# Altium schematic sheet PowerSwitch.SchDoc
size A
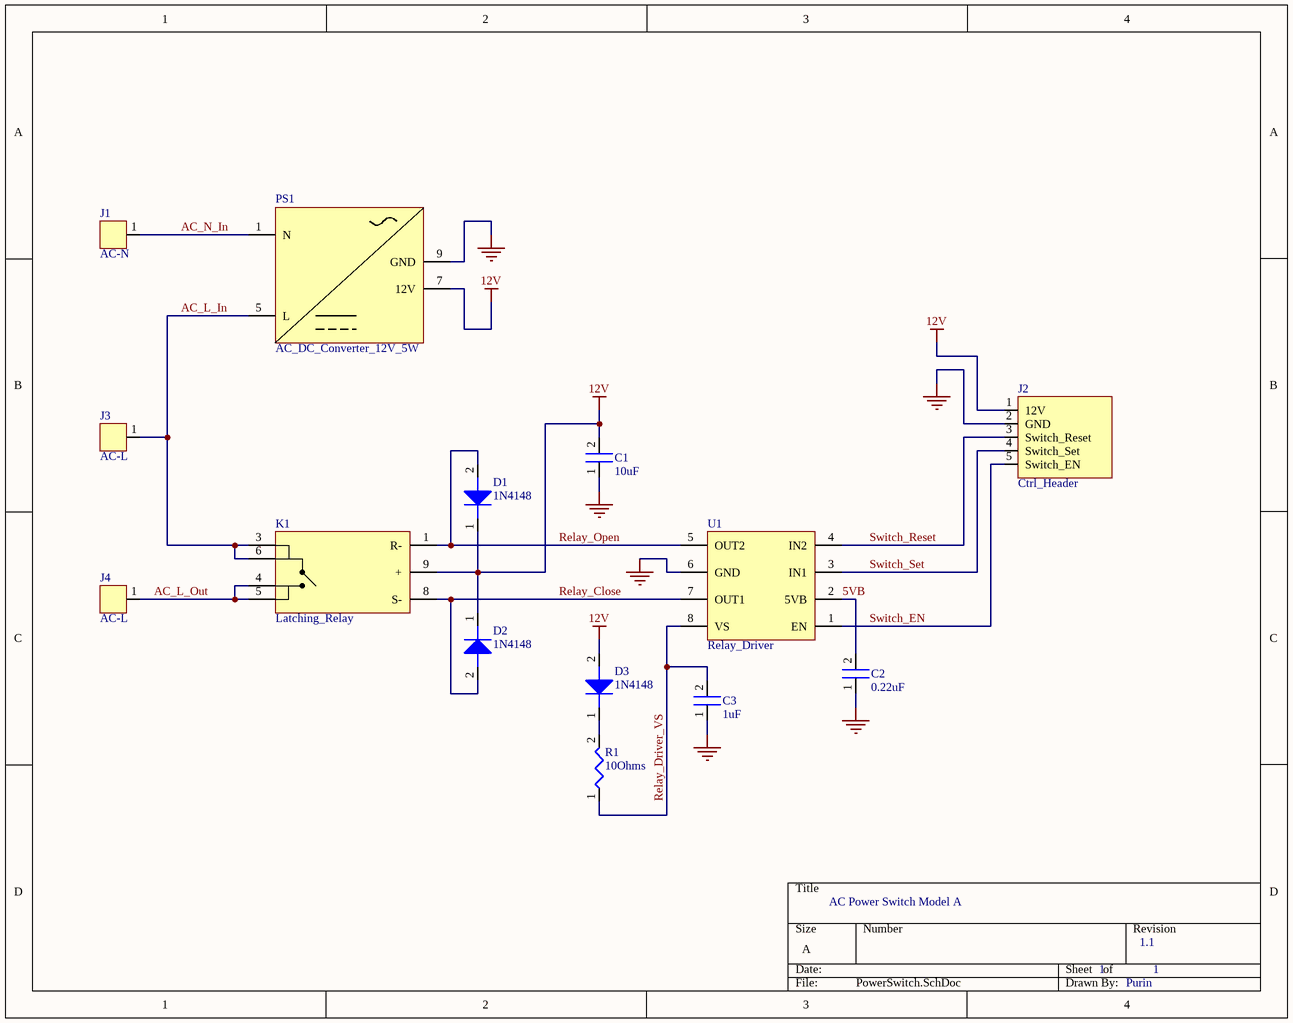
[diagram p0: PowerSwitch.SchDoc]

## Parts
C1  10uF  [C0805]
C2  0.22uF  [C0805]
C3  1uF  [C0805]
D1  1N4148  [1N4148SOD123]
D2  1N4148  [1N4148SOD123]
D3  1N4148  [1N4148SOD123]
J1  AC-N  [AC-HEADER]
J2  Ctrl_Header  [CTRL-HEADER]
J3  AC-L  [AC-HEADER]
J4  AC-L  [AC-HEADER]
K1  Latching_Relay  [G5RL-K1A-E]
PS1  AC_DC_Converter_12V_5W  [RAC05-K/277]
R1  10Ohms  [R0805]
U1  Relay_Driver  [FAN324X]

## Nets
12V: C1.2 D1.1 D2.1 D3.2 J2.1(12V) K1.9(+) PS1.7(12V)
GND: C1.1 C2.1 C3.1 J2.2(GND) PS1.9(GND) U1.6(GND)
5VB: C2.2 U1.2(5VB)
AC_L_In: J3.1(L) K1.3 K1.6 PS1.5(L)
AC_L_Out: J4.1(L) K1.4 K1.5
AC_N_In: J1.1(N) PS1.1(N)
Relay_Close: D2.2 K1.8(S-) U1.7(OUT1)
Relay_Driver_VS: C3.2 R1.1 U1.8(VS)
Relay_Open: D1.2 K1.1(R-) U1.5(OUT2)
Switch_EN: J2.5(Switch_EN) U1.1(EN)
Switch_Reset: J2.3(Switch_Reset) U1.4(IN2)
Switch_Set: J2.4(Switch_Set) U1.3(IN1)
NetD3_1: D3.1 R1.2

## Notes on the sheet
- AC Power Switch Model A
- 1
- 1.1
- Purin

## Library data of the parts
C1 = CL21B106KOQNNNE: 10µF ±10% 16V Ceramic Capacitor X7R 0805 (2012 Metric); Manufacturer: Samsung; Supplier 1: Digi-Key; Supplier Part Number 1: 1276-2872-1-ND; Manufacturer Part Number: CL21B106KOQNNNE; Stock 1: 6166622; Pricing 1: 1 = 0.30000, 10 = 0.20700, 100 = 0.11730, 500 = 0.08280, 1000 = 0.07245 (USD); Mount: Surface Mount; Case/Package: 0805; Case Code (Metric): 2012; Case Code (Imperial): 0805; Contact Plating: Tin; Min Operating Temperature: -55°C; Max Operating Temperature: 125°C; Tolerance: 10%; Packaging: Tape and Reel; Capacitance: 10uF; Voltage Rating: 16V; Package Quantity: 1; Dielectric: X7R; Voltage: 16V; Length: 2mm; Height: 1.25mm; Width: 0.049inch; Thickness: 0.055inch; Depth: 1.25mm; Radiation Hardening: No; ComponentLink1URL: https://datasheet.ciiva.com/16428/cl21b106koqnnne-16428887.pdf?src-supplier=Future+Electronics; ComponentLink1Description: https://datasheet.ciiva.com/16428/cl21b106koqnnne-16428887.pdf?src-supplier=Future+Electronics; ComponentLink2URL: https://datasheet.ciiva.com/25794/cl21b106koqnnne-25794472.pdf?src-supplier=Digi-Key; ComponentLink2Description: https://datasheet.ciiva.com/25794/cl21b106koqnnne-25794472.pdf?src-supplier=Digi-Key; ComponentLink3URL: https://datasheet.ciiva.com/26920/getdatasheetpartid-355170-26920201.pdf?src-supplier=Verical; ComponentLink3Description: https://datasheet.ciiva.com/26920/getdatasheetpartid-355170-26920201.pdf?src-supplier=Verical; ComponentLink4URL: http://datasheet.octopart.com/CL21B106KOQNNNE-Samsung-Electro-Mechanics-datasheet-11806859.pdf?src-supplier=Arrow; ComponentLink4Description: http://datasheet.octopart.com/CL21B106KOQNNNE-Samsung-Electro-Mechanics-datasheet-11806859.pdf?src-supplier=Arrow; ComponentLink5URL: http://datasheet.octopart.com/CL21B106KOQNNNE-Samsung-Electro-Mechanics-datasheet-81462191.pdf?src-supplier=Future+Electronics; ComponentLink5Description: http://datasheet.octopart.com/CL21B106KOQNNNE-Samsung-Electro-Mechanics-datasheet-81462191.pdf?src-supplier=Future+Electronics; ComponentLink6URL: http://datasheet.octopart.com/CL21B106KOQNNNE-Samsung-Electro-Mechanics-datasheet-8324245.pdf; ComponentLink6Description: http://datasheet.octopart.com/CL21B106KOQNNNE-Samsung-Electro-Mechanics-datasheet-8324245.pdf; ComponentLink7URL: http://datasheet.octopart.com/CL21B106KOQNNNE-Samsung-Electro-Mechanics-datasheet-116891046.pdf?src-supplier=Future+Electronics; ComponentLink7Description: http://datasheet.octopart.com/CL21B106KOQNNNE-Samsung-Electro-Mechanics-datasheet-116891046.pdf?src-supplier=Future+Electronics; ComponentLink8URL: http://datasheet.octopart.com/CL21B106KOQNNNE-Samsung-Electro-Mechanics-datasheet-136482503.pdf?src-supplier=Future+Electronics; ComponentLink8Description: http://datasheet.octopart.com/CL21B106KOQNNNE-Samsung-Electro-Mechanics-datasheet-136482503.pdf?src-supplier=Future+Electronics; ComponentLink9URL: http://datasheet.octopart.com/CL21B106KOQNNNE-Samsung-datasheet-12530662.pdf?src-supplier=Future+Electronics; ComponentLink9Description: http://datasheet.octopart.com/CL21B106KOQNNNE-Samsung-datasheet-12530662.pdf?src-supplier=Future+Electronics; ComponentLink10URL: http://datasheet.octopart.com/CL21B106KOQNNNE-Samsung-datasheet-26669285.pdf?src-supplier=Future+Electronics; ComponentLink10Description: http://datasheet.octopart.com/CL21B106KOQNNNE-Samsung-datasheet-26669285.pdf?src-supplier=Future+Electronics; Category: Ceramic Capacitors
C2 = CGA4J2X7R1H224K125AE: 0.22µF ±10% 50V Ceramic Capacitor X7R 0805 (2012 Metric); Manufacturer: TDK; Capacitance: 220nF; Supplier 1: Digi-Key; Supplier Part Number 1: 445-173771-1-ND; Manufacturer Part Number: CGA4J2X7R1H224K125AE; Stock 1: 7671; Pricing 1: 1 = 0.28000, 10 = 0.19000, 100 = 0.10790, 500 = 0.07618, 1000 = 0.06665 (USD); Mount: Surface Mount; Case/Package: 0805; Case Code (Metric): 2012; Case Code (Imperial): 0805; Min Operating Temperature: -55°C; Max Operating Temperature: 125°C; Packaging: Tape and Reel; Voltage Rating: 50V; Tolerance: 10%; Features: Soft Termination; Length: 0.079inch; Width: 0.047inch; Thickness: 0.059inch; Ratings: AEC-Q200; ComponentLink1URL: https://product.tdk.com/info/en/catalog/datasheets/mlcc_automotive_soft_en.pdf?src-supplier=Digi-Key; ComponentLink1Description: https://product.tdk.com/info/en/catalog/datasheets/mlcc_automotive_soft_en.pdf?src-supplier=Digi-Key; Category: Ceramic Capacitors
C3 = CGA4J3X7R1V105K125AB: 1µF ±10% 35V Ceramic Capacitor X7R 0805 (2012 Metric); Manufacturer: TDK; Supplier 1: Digi-Key; Supplier Part Number 1: 445-6962-1-ND; Manufacturer Part Number: CGA4J3X7R1V105K125AB; Stock 1: 3137; Pricing 1: 1 = 0.29000, 10 = 0.20100, 100 = 0.12080, 500 = 0.09056, 1000 = 0.07648 (USD); Mount: Surface Mount; Case/Package: 0805; Weight: 0.000194oz; Case Code (Imperial): 0805; Case Code (Metric): 2012; Min Operating Temperature: -55°C; Max Operating Temperature: 125°C; Tolerance: 10%; Packaging: Tape and Reel; Voltage Rating: 35V; Capacitance: 1uF; Voltage Rating (DC): 35V; Package Quantity: 1; Dielectric: X7R; Termination: SMD/SMT; Composition: Ceramic; Length: 2mm; Height: 1.25mm; Width: 1.25mm; Thickness: 0.057inch; Depth: 1.25mm; Ratings: AEC-Q200; REACH SVHC: No SVHC; Lead Free: Lead Free; ComponentLink1URL: https://datasheet.ciiva.com/24219/cga4j3x7r1v105k125ab-266016-24219602.pdf?src-supplier=Mouser; ComponentLink1Description: https://datasheet.ciiva.com/24219/cga4j3x7r1v105k125ab-266016-24219602.pdf?src-supplier=Mouser; ComponentLink2URL: https://datasheet.ciiva.com/8081/1807242-8081445.pdf?src-supplier=Element14; ComponentLink2Description: https://datasheet.ciiva.com/8081/1807242-8081445.pdf?src-supplier=Element14; ComponentLink3URL: https://datasheet.ciiva.com/22703/1807242-22703021.pdf?src-supplier=Element14; ComponentLink3Description: https://datasheet.ciiva.com/22703/1807242-22703021.pdf?src-supplier=Element14; ComponentLink4URL: http://datasheet.octopart.com/CGA4J3X7R1V105K125AB-TDK-datasheet-13376850.pdf?src-supplier=Newark; ComponentLink4Description: http://datasheet.octopart.com/CGA4J3X7R1V105K125AB-TDK-datasheet-13376850.pdf?src-supplier=Newark; ComponentLink5URL: http://datasheet.octopart.com/CGA4J3X7R1V105K125AB-TDK-datasheet-12542526.pdf?src-supplier=Newark; ComponentLink5Description: http://datasheet.octopart.com/CGA4J3X7R1V105K125AB-TDK-datasheet-12542526.pdf?src-supplier=Newark; ComponentLink6URL: http://datasheet.octopart.com/CGA4J3X7R1V105K125AB-TDK-datasheet-33009218.pdf?src-supplier=Newark; ComponentLink6Description: http://datasheet.octopart.com/CGA4J3X7R1V105K125AB-TDK-datasheet-33009218.pdf?src-supplier=Newark; ComponentLink7URL: http://datasheet.octopart.com/CGA4J3X7R1V105K125AB-TDK-datasheet-43366117.pdf?src-supplier=Newark; ComponentLink7Description: http://datasheet.octopart.com/CGA4J3X7R1V105K125AB-TDK-datasheet-43366117.pdf?src-supplier=Newark; ComponentLink8URL: http://datasheet.octopart.com/CGA4J3X7R1V105K125AB-TDK-datasheet-17817449.pdf?src-supplier=Future+Electronics; ComponentLink8Description: http://datasheet.octopart.com/CGA4J3X7R1V105K125AB-TDK-datasheet-17817449.pdf?src-supplier=Future+Electronics; ComponentLink9URL: http://datasheet.octopart.com/CGA4J3X7R1V105K125AB-TDK-datasheet-13423859.pdf?src-supplier=Future+Electronics; ComponentLink9Description: http://datasheet.octopart.com/CGA4J3X7R1V105K125AB-TDK-datasheet-13423859.pdf?src-supplier=Future+Electronics; Category: Ceramic Capacitors
D1-D3 = 1N4148W-7-F: Small Signal Diode, Single, 100 V, 300 Ma, 1.25 V, 4 Ns, 2 A Rohs Compliant: Yes; Manufacturer: Diodes Inc.; Max Surge Current: 2A; Forward Current: 150mA; Peak Reverse Current: 1uA; Recovery Time: 4ns; Forward Voltage: 1.25V; Average Rectified Current: 300mA; Max Repetitive Reverse Voltage (Vrrm): 100V; Power Dissipation: 400mW; Polarity: Standard; Voltage Rating (DC): 75V; Capacitance: 2pF; Current: 15A; Supplier 1: Digi-Key; Supplier Part Number 1: 1N4148W-FDICT-ND; Manufacturer Part Number: 1N4148W-7-F; Stock 1: 6304285; Pricing 1: 1 = 0.16000, 10 = 0.14900, 100 = 0.08100, 500 = 0.04986, 1000 = 0.03399 (USD); Mount: Surface Mount; Number of Pins: 2; Weight: 0.000353oz; Contact Plating: Tin; Min Operating Temperature: -65°C; Max Operating Temperature: 150°C; Package Quantity: 3000; Packaging: Tape and Reel; Reverse Recovery Time: 4ns; Max Forward Surge Current (Ifsm): 2A; Peak Non-Repetitive Surge Current: 2A; Element Configuration: Single; Power Rating: 400mW; Current Rating: 150mA; Output Current: 150mA; Voltage: 100V; Max Reverse Voltage (DC): 100V; Length: 2.85mm; Height: 1.25mm; Width: 1.7mm; Radiation Hardening: No; REACH SVHC: No SVHC; Lead Free: Lead Free; ComponentLink1URL: https://datasheet.ciiva.com/911/ds30086-911734.pdf?src-supplier=Digi-Key; ComponentLink1Description: https://datasheet.ciiva.com/911/ds30086-911734.pdf?src-supplier=Digi-Key; ComponentLink2URL: https://datasheet.ciiva.com/911/ds30086-911735.pdf?src-supplier=Digi-Key; ComponentLink2Description: https://datasheet.ciiva.com/911/ds30086-911735.pdf?src-supplier=Digi-Key; ComponentLink3URL: https://datasheet.ciiva.com/22695/1915529-22695239.pdf?src-supplier=Element14; ComponentLink3Description: https://datasheet.ciiva.com/22695/1915529-22695239.pdf?src-supplier=Element14; ComponentLink4URL: https://datasheet.ciiva.com/911/ds30086-911736.pdf?src-supplier=Digi-Key; ComponentLink4Description: https://datasheet.ciiva.com/911/ds30086-911736.pdf?src-supplier=Digi-Key; ComponentLink5URL: https://datasheet.ciiva.com/1179/1915529-1179304.pdf?src-supplier=Element14; ComponentLink5Description: https://datasheet.ciiva.com/1179/1915529-1179304.pdf?src-supplier=Element14; ComponentLink6URL: https://datasheet.ciiva.com/4435/ds30086-4435128.pdf?src-supplier=Mouser; ComponentLink6Description: https://datasheet.ciiva.com/4435/ds30086-4435128.pdf?src-supplier=Mouser; ComponentLink7URL: https://datasheet.ciiva.com/8300/ds30086-8300392.pdf?src-supplier=Avnet; ComponentLink7Description: https://datasheet.ciiva.com/8300/ds30086-8300392.pdf?src-supplier=Avnet; ComponentLink8URL: https://datasheet.ciiva.com/25919/ds30086-25919609.pdf?src-supplier=Avnet+Europe; ComponentLink8Description: https://datasheet.ciiva.com/25919/ds30086-25919609.pdf?src-supplier=Avnet+Europe; ComponentLink9URL: https://datasheet.ciiva.com/15219/getdatasheetpartid-110030-15219548.pdf?src-supplier=Verical; ComponentLink9Description: https://datasheet.ciiva.com/15219/getdatasheetpartid-110030-15219548.pdf?src-supplier=Verical; ComponentLink10URL: https://datasheet.ciiva.com/8303/ds30086-8303197.pdf?src-supplier=Avnet; ComponentLink10Description: https://datasheet.ciiva.com/8303/ds30086-8303197.pdf?src-supplier=Avnet; ComponentLink11URL: http://datasheet.octopart.com/1N4148W-7-F-Diodes-Inc.-datasheet-8327071.pdf?src-supplier=Farnell; ComponentLink11Description: http://datasheet.octopart.com/1N4148W-7-F-Diodes-Inc.-datasheet-8327071.pdf?src-supplier=Farnell; ComponentLink12URL: http://datasheet.octopart.com/1N4148W-7-F-Diodes-Inc.-datasheet-8372061.pdf?src-supplier=Farnell; ComponentLink12Description: http://datasheet.octopart.com/1N4148W-7-F-Diodes-Inc.-datasheet-8372061.pdf?src-supplier=Farnell; ComponentLink13URL: http://datasheet.octopart.com/1N4148W-7-F-Diodes-Inc.-datasheet-12518151.pdf?src-supplier=Farnell; ComponentLink13Description: http://datasheet.octopart.com/1N4148W-7-F-Diodes-Inc.-datasheet-12518151.pdf?src-supplier=Farnell; ComponentLink14URL: http://datasheet.octopart.com/1N4148W-7-F-Diodes-Inc.-datasheet-46750349.pdf?src-supplier=Element14; ComponentLink14Description: http://datasheet.octopart.com/1N4148W-7-F-Diodes-Inc.-datasheet-46750349.pdf?src-supplier=Element14; ComponentLink15URL: http://datasheet.octopart.com/1N4148W-7-F-Diodes-Inc.-datasheet-65537886.pdf?src-supplier=Element14; ComponentLink15Description: http://datasheet.octopart.com/1N4148W-7-F-Diodes-Inc.-datasheet-65537886.pdf?src-supplier=Element14; ComponentLink16URL: http://datasheet.octopart.com/1N4148W-7-F-Diodes-Inc.-datasheet-34441418.pdf?src-supplier=Farnell; ComponentLink16Description: http://datasheet.octopart.com/1N4148W-7-F-Diodes-Inc.-datasheet-34441418.pdf?src-supplier=Farnell; ComponentLink17URL: http://datasheet.octopart.com/1N4148W-7-F-Diodes-Inc.-datasheet-81411345.pdf?src-supplier=Megastar; ComponentLink17Description: http://datasheet.octopart.com/1N4148W-7-F-Diodes-Inc.-datasheet-81411345.pdf?src-supplier=Megastar; ComponentLink18URL: http://datasheet.octopart.com/1N4148W-7-F-Diodes-Inc.-datasheet-40287.pdf?src-supplier=Mouser; ComponentLink18Description: http://datasheet.octopart.com/1N4148W-7-F-Diodes-Inc.-datasheet-40287.pdf?src-supplier=Mouser; ComponentLink19URL: http://datasheet.octopart.com/1N4148W-7-F-Diodes-Inc.-datasheet-131508.pdf?src-supplier=Digi-Key; ComponentLink19Description: http://datasheet.octopart.com/1N4148W-7-F-Diodes-Inc.-datasheet-131508.pdf?src-supplier=Digi-Key; ComponentLink20URL: http://datasheet.octopart.com/1N4148W-7-F-Diodes-Inc.-datasheet-11856225.pdf?src-supplier=Arrow; ComponentLink20Description: http://datasheet.octopart.com/1N4148W-7-F-Diodes-Inc.-datasheet-11856225.pdf?src-supplier=Arrow; ComponentLink21URL: http://datasheet.octopart.com/1N4148W-7-F-Diodes-Inc.-datasheet-14053747.pdf?src-supplier=IIIC; ComponentLink21Description: http://datasheet.octopart.com/1N4148W-7-F-Diodes-Inc.-datasheet-14053747.pdf?src-supplier=IIIC
J1 = AC-N-Header
J2 = Ctrl-Header
J3 J4 = AC-L-Header
K1 = G5RL-K1A-E-DC12: General Purpose Relay, G5rl-K Series, Power, Latching Dual Coil, Spst-No, 12 Vdc, 16 A; Manufacturer: Omron; Coil Current: 62.5mA; Throw Configuration: SPST; Operate Time: 15ms; Coil Power: 750mW; Coil Resistance: 192R; Coil Type: Latching, Dual Coil; Coil Voltage (DC): 12V; Contact Current Rating: 16A; Supplier 1: Digi-Key; Manufacturer Part Number: G5RL-K1A-E-DC12; Stock 1: 423; Pricing 1: 1 = 3.91000, 10 = 3.66600, 25 = 3.25880, 50 = 3.09580, 100 = 2.93280, 300 = 2.60697, 500 = 2.44404, 1000 = 2.28110 (USD); Mount: Through Hole; Contact Material: Silver; Min Operating Temperature: -40°C; Max Operating Temperature: 85°C; Package Quantity: 100; Packaging: Rail/Tube; Release Time: 15ms; Termination: PC Pin; Relay Type: General Purpose; REACH SVHC: No SVHC; ComponentLink1URL: http://www.farnell.com/datasheets/1836111.pdf?src-supplier=Farnell; ComponentLink1Description: http://www.farnell.com/datasheets/1836111.pdf?src-supplier=Farnell; ComponentLink2URL: http://www.mouser.com/ds/2/307/en-g5rl-531959.pdf?src-supplier=Mouser; ComponentLink2Description: http://www.mouser.com/ds/2/307/en-g5rl-531959.pdf?src-supplier=Mouser; ComponentLink3URL: https://omronfs.omron.com/en_US/ecb/products/pdf/en-g5rl_uk.pdf?src-supplier=Digi-Key; ComponentLink3Description: https://omronfs.omron.com/en_US/ecb/products/pdf/en-g5rl_uk.pdf?src-supplier=Digi-Key; ComponentLink4URL: http://datasheet.octopart.com/G5RLK1AEDC12-Omron-datasheet-28360223.pdf?src-supplier=TME; ComponentLink4Description: http://datasheet.octopart.com/G5RLK1AEDC12-Omron-datasheet-28360223.pdf?src-supplier=TME; Supplier Part Number 1: Z4393-ND; Category: Relays
PS1 = RAC05-12SK/277: Enclosed AC DC Converter 1 Output 12V    416mA 85 ~ 305 VAC, 120 ~ 430 VDC Input; Manufacturer: Recom Power; Supplier 1: Digi-Key; Supplier Part Number 1: 945-3192-ND; Manufacturer Part Number: RAC05-12SK/277; Stock 1: 70; Pricing 1: 1 = 10.15000, 5 = 10.00600, 12 = 9.86000, 36 = 9.28000, 60 = 8.99000, 108 = 8.70000, 252 = 8.41000, 504 = 8.12000 (USD); ComponentLink1URL: http://datasheet.octopart.com/RAC05-12SK-277-Recom-Power-datasheet-133924409.pdf?src-supplier=Recom+Power; ComponentLink1Description: http://datasheet.octopart.com/RAC05-12SK-277-Recom-Power-datasheet-133924409.pdf?src-supplier=Recom+Power; Category: AC DC Converters
R1 = CRCW080510R0FKEAC: 10 Ohms ±1% 0.125W, 1/8W Chip Resistor 0805 (2012 Metric)  Thick Film; Manufacturer: Vishay; Power Rating: 125mW; Resistance: 10R; Temperature Coefficient: 100ppm/°C; Supplier 1: Digi-Key; Supplier Part Number 1: 541-4132-1-ND; Manufacturer Part Number: CRCW080510R0FKEAC; Stock 1: 351996; Pricing 1: 1 = 0.10000, 10 = 0.06300, 100 = 0.02560, 1000 = 0.01149, 2500 = 0.00997 (USD); Mount: Surface Mount; Case/Package: Molded; Contact Plating: Tin; Min Operating Temperature: -55°C; Max Operating Temperature: 155°C; Tolerance: 1%; Composition: Thick Film; Termination: Wraparound; Length: 2mm; Lead Free: Lead Free; ComponentLink1URL: http://www.vishay.com/docs/20035/dcrcwe3.pdf?src-supplier=Avnet+Asia; ComponentLink1Description: http://www.vishay.com/docs/20035/dcrcwe3.pdf?src-supplier=Avnet+Asia; ComponentLink2URL: http://www.vishay.com/docs/20035/dcrcwe3.pdf?src-supplier=Avnet; ComponentLink2Description: http://www.vishay.com/docs/20035/dcrcwe3.pdf?src-supplier=Avnet; ComponentLink3URL: http://www.vishay.com/docs/28773/crcwce3.pdf?src-supplier=Digi-Key; ComponentLink3Description: http://www.vishay.com/docs/28773/crcwce3.pdf?src-supplier=Digi-Key; Category: Chip Resistor - Surface Mount
U1 = FAN3240TMX: FAN3240TMX, Dual-Channel Latching Relay Driver; Manufacturer: ON Semiconductor; Plating: Tin; Number of Outputs: 2; Max Supply Voltage: 60V; Min Supply Voltage: 8V; Max Output Current: 1A; Output Current: 5mA; Nominal Supply Current: 400uA; On-State Resistance: 1R; Max Supply Current: 600uA; Wire Gauge (Max): 18AWG; Wire Gauge (Min): 14AWG; Supplier 1: Digi-Key; Supplier Part Number 1: FAN3240TMXCT-ND; Manufacturer Part Number: FAN3240TMX; Stock 1: 3644; Pricing 1: 1 = 1.55000, 10 = 1.38300, 100 = 1.07790, 500 = 0.89044, 1000 = 0.70298 (USD); Mount: Surface Mount; Case/Package: SOIC; Number of Pins: 8; Weight: 0.2304g; Color: Black; Material: Metal; Min Operating Temperature: -40°C; Max Operating Temperature: 105°C; Package Quantity: 100; Packaging: Tape and Reel; Output Voltage: 60V; Termination: Crimp; Number of Drivers: 2; Voltage: 60V; Current: 5mA; Max Output Voltage: 60V; Diameter: 0.5inch; Length: 4.9mm; Height: 0.625inch; Width: 3.9mm; Radiation Hardening: No; Lead Free: Lead Free; ComponentLink1URL: https://datasheet.ciiva.com/14940/fan3240-14940148.pdf?src-supplier=Digi-Key; ComponentLink1Description: https://datasheet.ciiva.com/14940/fan3240-14940148.pdf?src-supplier=Digi-Key; ComponentLink2URL: https://datasheet.ciiva.com/29985/fan3241-29985974.pdf?src-supplier=Avnet; ComponentLink2Description: https://datasheet.ciiva.com/29985/fan3241-29985974.pdf?src-supplier=Avnet; ComponentLink3URL: https://datasheet.ciiva.com/12217/fan3241-221700-12217195.pdf?src-supplier=Mouser; ComponentLink3Description: https://datasheet.ciiva.com/12217/fan3241-221700-12217195.pdf?src-supplier=Mouser; ComponentLink4URL: https://datasheet.ciiva.com/14940/fan3240-14940149.pdf?src-supplier=Digi-Key; ComponentLink4Description: https://datasheet.ciiva.com/14940/fan3240-14940149.pdf?src-supplier=Digi-Key; ComponentLink5URL: http://datasheet.octopart.com/FAN3240TMX-ON-Semiconductor-datasheet-85445215.pdf?src-supplier=ON+Semiconductor; ComponentLink5Description: http://datasheet.octopart.com/FAN3240TMX-ON-Semiconductor-datasheet-85445215.pdf?src-supplier=ON+Semiconductor; ComponentLink6URL: http://datasheet.octopart.com/FAN3240TMX-ON-Semiconductor-datasheet-86690032.pdf?src-supplier=ON+Semiconductor; ComponentLink6Description: http://datasheet.octopart.com/FAN3240TMX-ON-Semiconductor-datasheet-86690032.pdf?src-supplier=ON+Semiconductor; ComponentLink7URL: http://datasheet.octopart.com/FAN3240TMX-Fairchild-Semiconductor-datasheet-15994581.pdf; ComponentLink7Description: http://datasheet.octopart.com/FAN3240TMX-Fairchild-Semiconductor-datasheet-15994581.pdf; ComponentLink8URL: http://datasheet.octopart.com/FAN3240TMX-ON-Semiconductor-datasheet-30893411.pdf?src-supplier=Fairchild+Semiconductor; ComponentLink8Description: http://datasheet.octopart.com/FAN3240TMX-ON-Semiconductor-datasheet-30893411.pdf?src-supplier=Fairchild+Semiconductor; ComponentLink9URL: http://sigma.octopart.com/17345426/technical_drawing/Fairchild-Semiconductor-FAN3240TMX.pdf?src-supplier=Fairchild+Semiconductor; ComponentLink9Description: http://sigma.octopart.com/17345426/technical_drawing/Fairchild-Semiconductor-FAN3240TMX.pdf?src-supplier=Fairchild+Semiconductor; ComponentLink10URL: http://sigma.octopart.com/33068652/technical_drawing/Fairchild-Semiconductor-FAN3240TMX.pdf?src-supplier=Fairchild+Semiconductor; ComponentLink10Description: http://sigma.octopart.com/33068652/technical_drawing/Fairchild-Semiconductor-FAN3240TMX.pdf?src-supplier=Fairchild+Semiconductor; Category: Integrated Circuits (ICs)